# EAGLE design M896 (EAGLE 6.6.0)
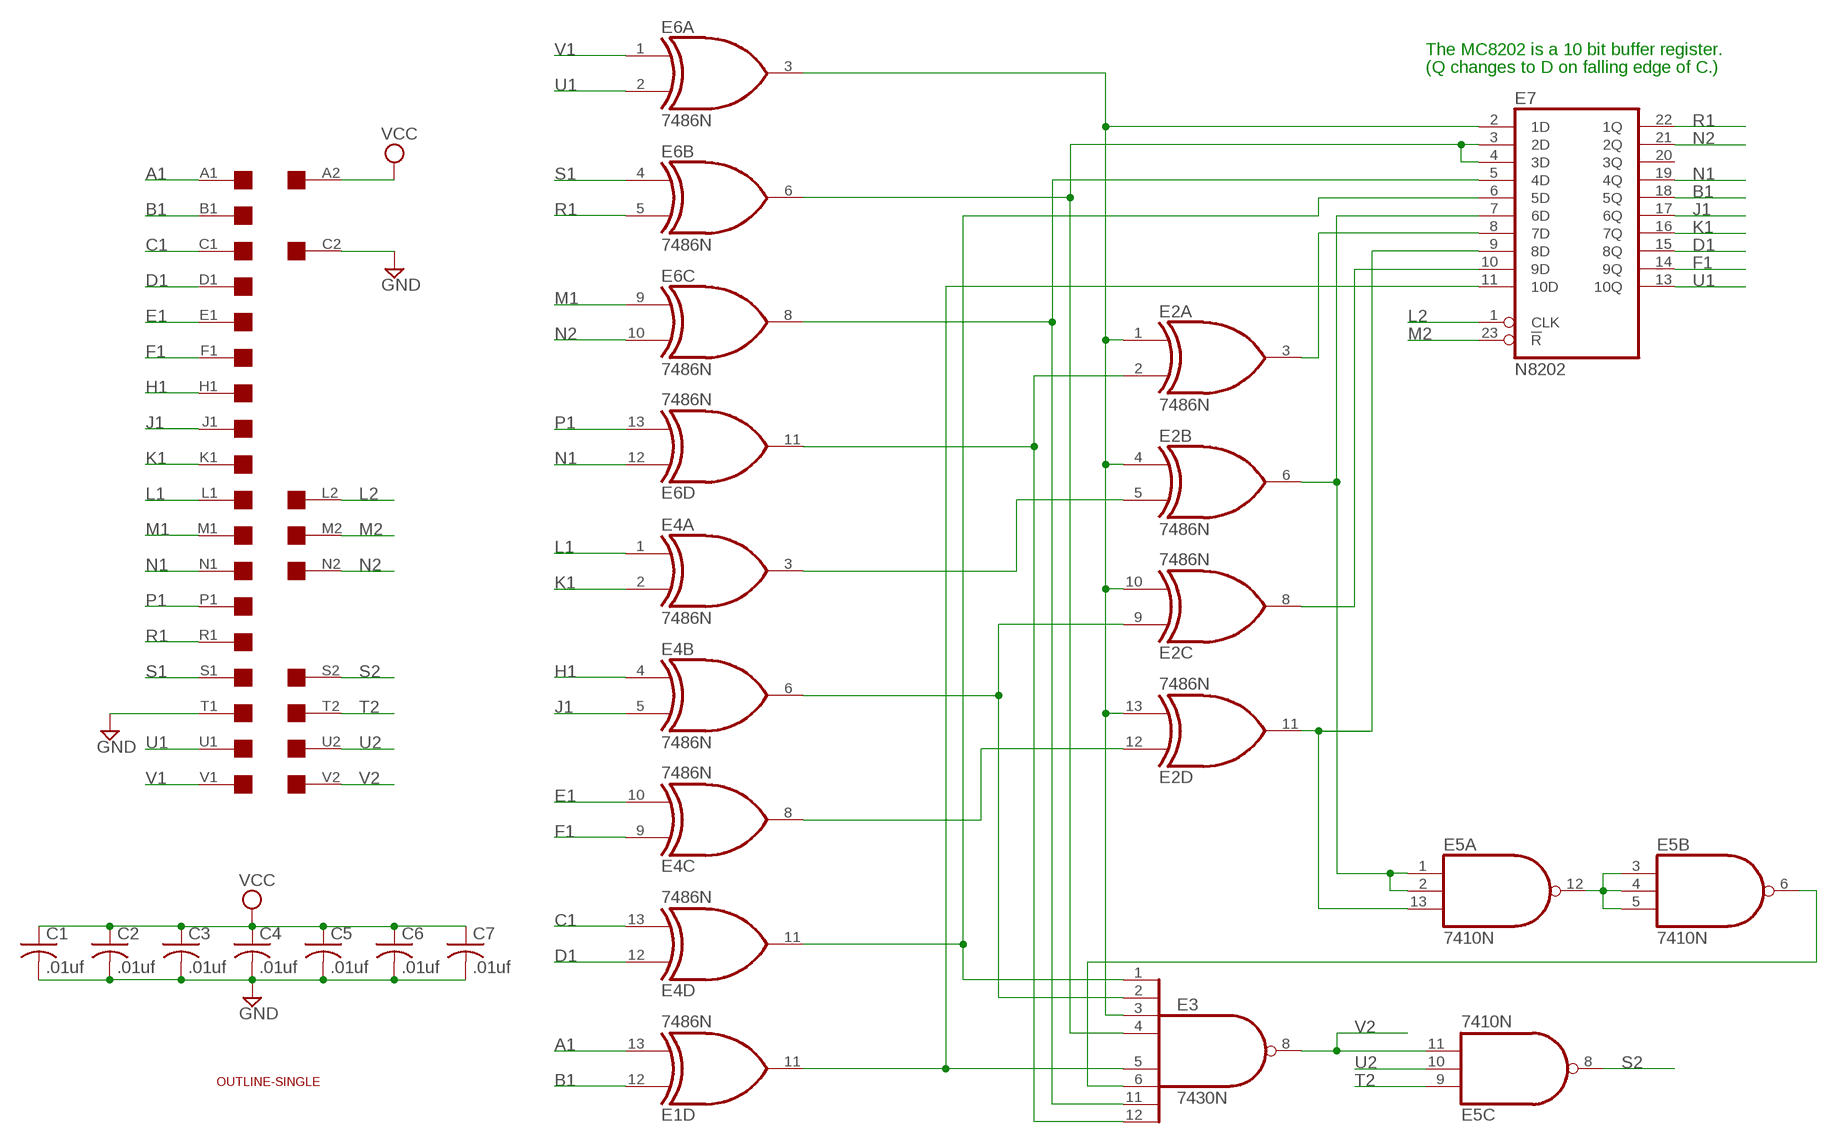
[diagram p0: schematic, sheet 1]

## Parts
C1  .01uf  C-US050-025X075  [C050-025X075]
C2  .01uf  C-US050-025X075  [C050-025X075]
C3  .01uf  C-US050-025X075  [C050-025X075]
C4  .01uf  C-US050-025X075  [C050-025X075]
C5  .01uf  C-US050-025X075  [C050-025X075]
C6  .01uf  C-US050-025X075  [C050-025X075]
C7  .01uf  C-US050-025X075  [C050-025X075]
E1  7486N  [DIL14]
E2  7486N  [DIL14]
E3  7430N  [DIL14]
E4  7486N  [DIL14]
E5  7410N  [DIL14]
E6  7486N  [DIL14]
E7  N8202  [DIL24]
U$1  EDGE-2CONNECTOR  [EDGE-CON2]
U$4  OUTLINE-SINGLE  [SINGLE]

## Nets
A1: E1.13(D:I1) U$1.A1
B1: E1.12(D:I0) E7.18(5Q) U$1.B1
C1: E4.13(D:I1) U$1.C1
D1: E4.12(D:I0) E7.15(8Q) U$1.D1
E1: E4.10(C:I1) U$1.E1
F1: E4.9(C:I0) E7.14(9Q) U$1.F1
GND [power]: C1.2 C2.2 C3.2 C4.2 C5.2 C6.2 C7.2 U$1.C2 U$1.T1
H1: E4.4(B:I0) U$1.H1
J1: E4.5(B:I1) E7.17(6Q) U$1.J1
K1: E4.2(A:I1) E7.16(7Q) U$1.K1
L1: E4.1(A:I0) U$1.L1
L2: E7.1(CLK) U$1.L2
M1: E6.9(C:I0) U$1.M1
M2: E7.23(!R) U$1.M2
N1: E6.12(D:I0) E7.19(4Q) U$1.N1
N2: E6.10(C:I1) E7.21(2Q) U$1.N2
N$1: E2.1(A:I0) E2.4(B:I0) E2.10(C:I1) E2.13(D:I1) E3.3(I2) E6.3(A:O) E7.2(1D)
N$2: E2.2(A:I1) E3.12(I7) E6.11(D:O)
N$3: E2.5(B:I1) E4.3(A:O)
N$4: E2.9(C:I0) E3.2(I1) E4.6(B:O)
N$5: E2.12(D:I0) E4.8(C:O)
N$6: E1.11(D:O) E3.5(I4) E7.11(10D)
N$7: E3.1(I0) E4.11(D:O) E7.6(5D)
N$8: E5.3(B:I0) E5.4(B:I1) E5.5(B:I2) E5.12(A:O)
N$9: E3.11(I6) E6.8(C:O) E7.5(4D)
N$10: E3.4(I3) E6.6(B:O) E7.3(2D) E7.4(3D)
N$11: E3.6(I5) E5.6(B:O)
N$12: E2.6(B:O) E5.1(A:I0) E5.2(A:I1) E7.7(6D)
N$13: E2.11(D:O) E5.13(A:I2) E7.9(8D)
N$14: E2.3(A:O) E7.8(7D)
N$15: E2.8(C:O) E7.10(9D)
P1: E6.13(D:I1) U$1.P1
R1: E6.5(B:I1) E7.22(1Q) U$1.R1
S1: E6.4(B:I0) U$1.S1
S2: E5.8(C:O) U$1.S2
T2: E5.9(C:I0) U$1.T2
U1: E6.2(A:I1) E7.13(10Q) U$1.U1
U2: E5.10(C:I1) U$1.U2
V1: E6.1(A:I0) U$1.V1
V2: E3.8(O) E5.11(C:I2) U$1.V2
VCC [power]: C1.1 C2.1 C3.1 C4.1 C5.1 C6.1 C7.1 U$1.A2
Unconnected: E1.1(A:I0) E1.2(A:I1) E1.3(A:O) E1.4(B:I0) E1.5(B:I1) E1.6(B:O) E1.8(C:O) E1.9(C:I0) E1.10(C:I1) E7.20(3Q) U$1.B2 U$1.D2 U$1.E2 U$1.F2 U$1.H2 U$1.J2 U$1.K2 U$1.P2 U$1.R2

## Notes on the sheet
- The MC8202 is a 10 bit buffer register.
- (Q changes to D on falling edge of C.)

## Power pins joined to a net without a drawn wire
GND: E1.7(P:GND) E2.7(P:GND) E3.7(GND) E4.7(P:GND) E5.7(P:GND) E6.7(P:GND) E7.12(GND)
VCC: E1.14(P:VCC) E2.14(P:VCC) E3.14(VCC) E4.14(P:VCC) E5.14(P:VCC) E6.14(P:VCC) E7.24(VCC)

## Library data of the parts
C1-C7 = rcl:C-US: CAPACITOR, American symbol
E1 E2 E4 E6 = 74xx-us:74*86: Quad 2-input EXCLUSIV-OR (XOR) gate
E3 = 74xx-us:74*30: 8-input NAND gate
E5 = 74xx-us:74*10: Triple 3-input NAND gate
E7 = dec-con:N8202: 10 bit register
U$1 = dec-con:EDGE-2: Double-Sided DEC edge connector.
U$4 = dec-con:OUTLINE-*: Board outlines for DEC boards.

## Net classes
1 power: width 0.508 mm

## Board
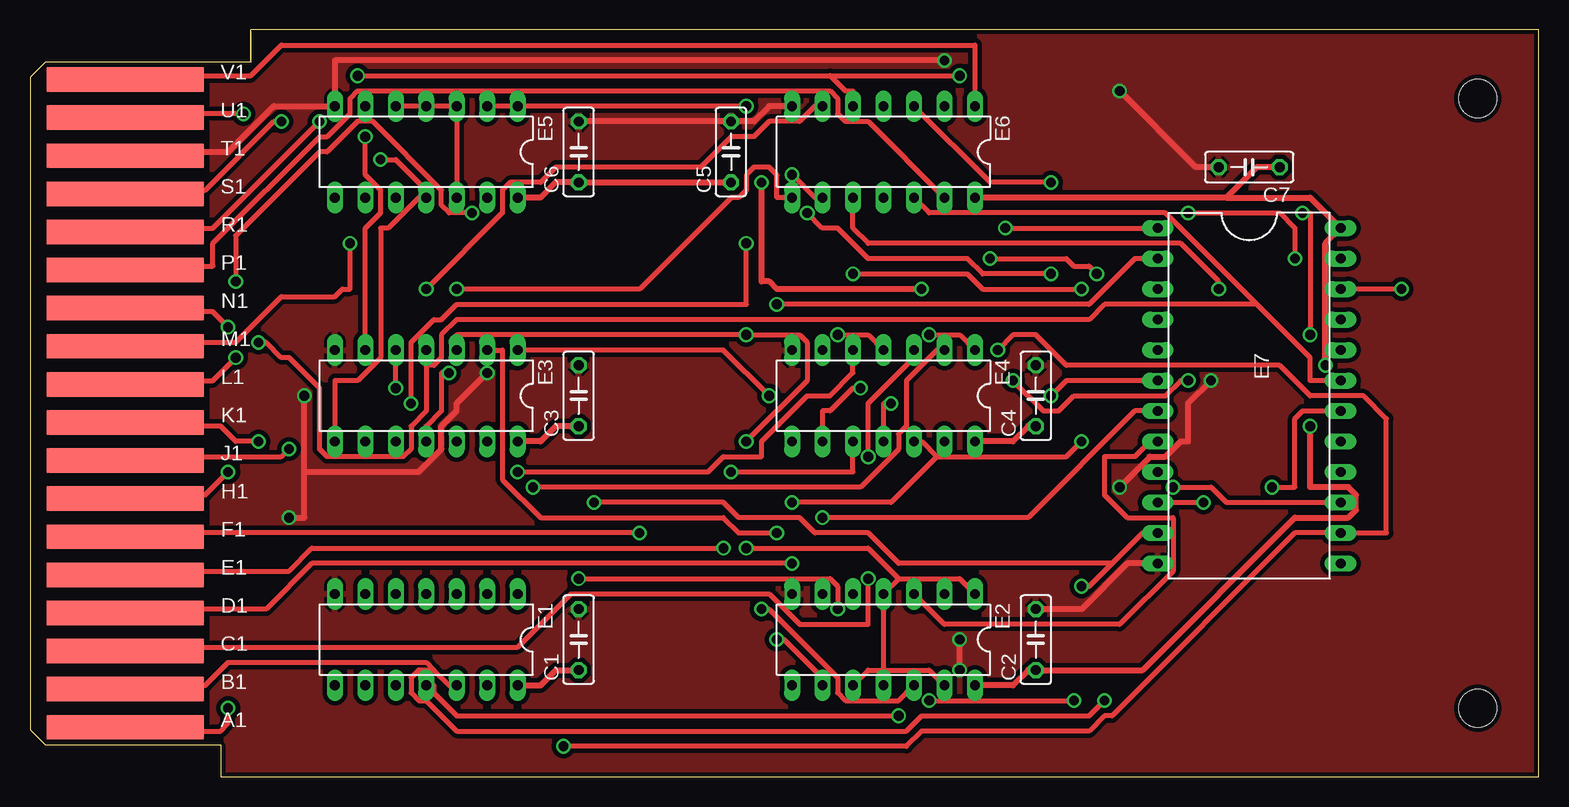
[diagram p1: board, top side]
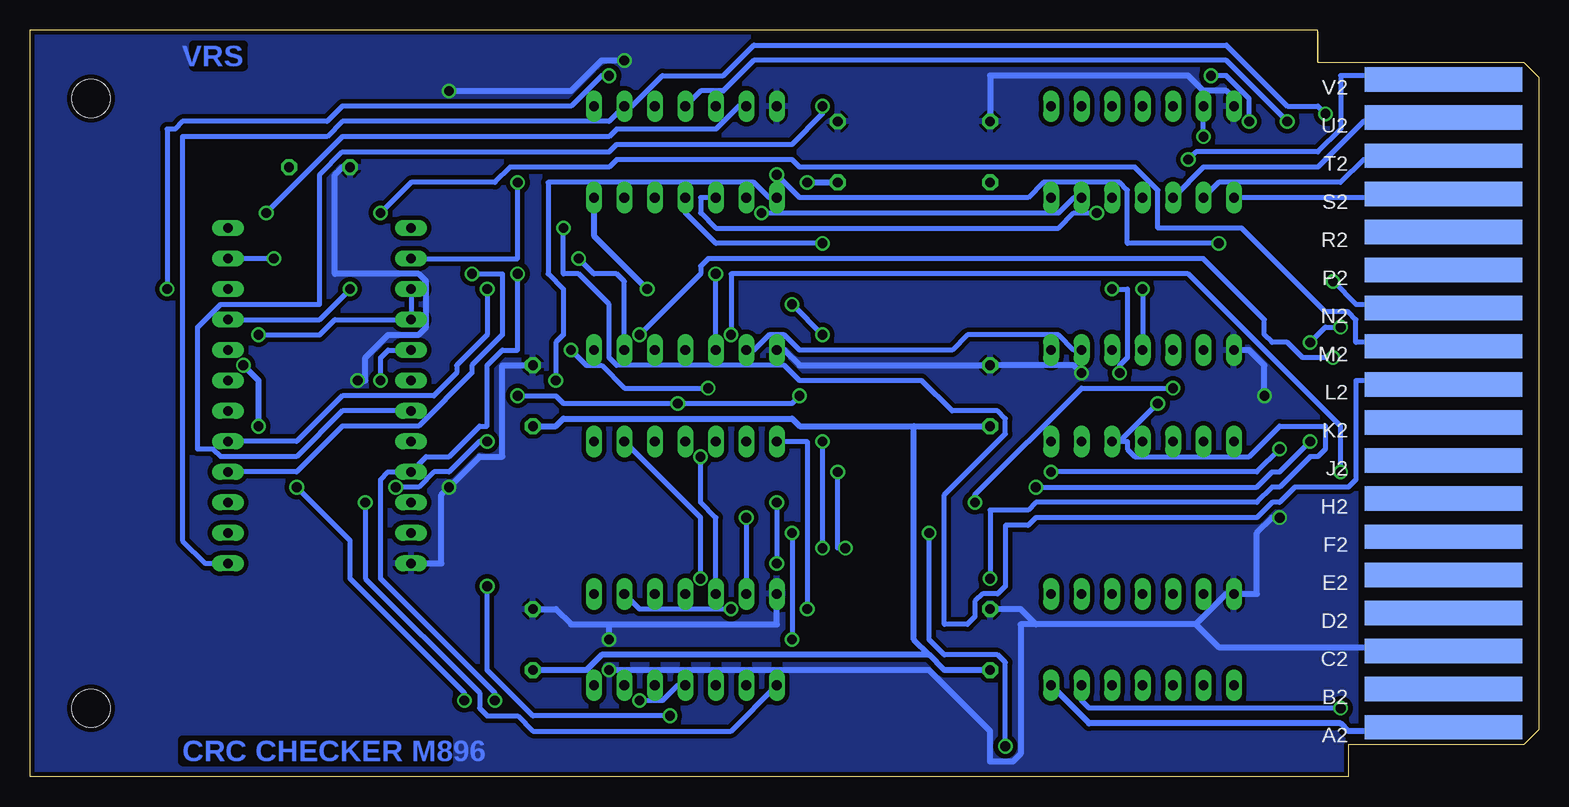
[diagram p2: board, bottom side, seen from below]

Size 125.73 x 62.23 mm. Coordinates in mm from the lower left corner, seen from the top.
Copper layers (1+16): Top 0.035mm / dielectric 1.5mm / Bottom 0.035mm
Design rules "16mils": minimum track width 16mil, minimum drill 32mil, track to track 15mil, track to pad 10mil, pad to pad 10mil, via to via 10mil, smd to smd 10mil, copper to edge 13mil, drill to drill 10mil, minimum pad ring 10mil, minimum via ring 8mil, stop-mask expansion 0mil, vias tented up to drill 0mil, thermal gap 10mil

### Footprints (pad centres in the part's own frame; a part is rotated, then mirrored left to right if it is on the bottom)
C050-025X075 = drill 0.813 octagon: 1 -2.54,0; 2 2.54,0
DIL14 = drill 0.813 long: 1 -7.62,-3.81; 2 -5.08,-3.81; 3 -2.54,-3.81; 4 0,-3.81; 5 2.54,-3.81; 6 5.08,-3.81; 7 7.62,-3.81; 8 7.62,3.81; 9 5.08,3.81; 10 2.54,3.81; 11 0,3.81; 12 -2.54,3.81; 13 -5.08,3.81; 14 -7.62,3.81
DIL24 = drill 0.813 long: 1 -12.7,-7.62; 2 -10.16,-7.62; 3 -7.62,-7.62; 4 -5.08,-7.62; 5 -2.54,-7.62; 6 0,-7.62; 7 2.54,-7.62; 8 5.08,-7.62; 9 7.62,-7.62; 10 10.16,-7.62; 11 12.7,-7.62; 12 15.24,-7.62; 13 15.24,7.62; 14 12.7,7.62; 15 10.16,7.62; 16 7.62,7.62; 17 5.08,7.62; 18 2.54,7.62; 19 0,7.62; 20 -2.54,7.62; 21 -5.08,7.62; 22 -7.62,7.62; 23 -10.16,7.62; 24 -12.7,7.62
EDGE-CON2 = smd 13.106 x 2.032: A1 7.938,4.128; B1 7.938,7.303; C1 7.938,10.477; D1 7.938,13.652; E1 7.938,16.828; F1 7.938,20.003; H1 7.938,23.177; J1 7.938,26.352; K1 7.938,29.527; L1 7.938,32.703; M1 7.938,35.877; N1 7.938,39.053; P1 7.938,42.227; R1 7.938,45.403; S1 7.938,48.578; T1 7.938,51.752; U1 7.938,54.928; V1 7.938,58.102 | smd 13.106 x 2.032 bottom: A2 7.938,4.128; B2 7.938,7.303; C2 7.938,10.477; D2 7.938,13.652; E2 7.938,16.828; F2 7.938,20.003; H2 7.938,23.177; J2 7.938,26.352; K2 7.938,29.527; L2 7.938,32.703; M2 7.938,35.877; N2 7.938,39.053; P2 7.938,42.227; R2 7.938,45.403; S2 7.938,48.578; T2 7.938,51.752; U2 7.938,54.928; V2 7.938,58.102
SINGLE = hole 3.175: 120.65,56.515; 120.65,5.715

### Placement (x,y rotation side)
C1  45.72,11.43 90 top
C2  83.82,11.43 90 top
C3  45.72,31.75 90 top
C4  83.82,31.75 90 top
C5  58.42,52.07 90 top
C6  45.72,52.07 90 top
C7  101.6,50.8 180 top
E1  33.02,11.43 180 top
E2  71.12,11.43 180 top
E3  33.02,31.75 180 top
E4  71.12,31.75 180 top
E5  33.02,52.07 180 top
E6  71.12,52.07 180 top
E7  101.6,33.02 270 top
U$1  0,0 0 top
U$4  0,0 0 top

### Tracks (layer width: path | path; a pad name or v marks a point on that pad's centre or on a via)
A1  (via drill 0.81)
  Top 0.406: v16.51,5.71 16.51,4.45 15.88,3.81 8.26,3.81 U$1.A1
  Bottom 0.406: E1.13 38.1,6.35 37.47,5.71 v16.51,5.71
B1  (via drill 0.81)
  Top 0.406: E1.12 34.93,7.62 33.66,8.89 | 33.66,8.89 33.02,9.53 16.51,9.53 14.61,7.62 8.26,7.62 U$1.B1 | E7.18 106.05,30.48 105.41,29.84 105.41,24.13 v103.51,24.13 | v89.54,6.35 88.27,5.08 74.3,5.08 73.03,3.81 35.56,3.81 33.02,6.35 32.39,6.35 31.75,6.99 31.75,8.26 32.39,8.89 33.66,8.89
  Bottom 0.406: v103.51,24.13 99.06,19.68 99.06,16.51 89.54,6.99 v89.54,6.35
C1  (via drill 0.81)
  Top 0.406: v69.85,16.51 69.85,12.7 64.14,12.7 61.6,15.24 45.09,15.24 40.64,10.79 8.26,10.79 U$1.C1
  Bottom 0.406: E4.13 69.85,21.59 v69.85,16.51
D1  (via drill 0.81)
  Top 0.406: E7.15 99.7,22.86 98.43,24.13 v95.25,24.13 | v87.63,27.94 86.36,26.67 75.57,26.67 | 75.57,26.67 74.3,27.94 E4.12 | v63.5,17.78 23.5,17.78 19.69,13.97 8.26,13.97 U$1.D1 | v63.5,22.86 71.76,22.86 75.57,26.67
  Bottom 0.406: v95.25,24.13 93.35,24.13 92.08,25.4 90.81,25.4 88.27,27.94 v87.63,27.94 | v63.5,22.86 v63.5,17.78
E1  (via drill 0.81)
  Top 0.406: E4.10 68.58,25.4 v58.42,25.4 | v57.79,19.05 23.5,19.05 21.59,17.14 8.26,17.14 U$1.E1
  Bottom 0.406: v58.42,25.4 58.42,19.05 v57.79,19.05
F1  (via drill 0.81)
  Top 0.406: E4.9 66.04,30.48 66.68,30.48 68.58,32.38 v69.22,32.38 | v80.65,35.56 81.92,36.83 83.82,36.83 86.36,34.29 104.14,34.29 106.68,31.75 111.13,31.75 113.03,29.84 113.03,20.32 E7.14 105.41,20.32 90.17,5.08 89.54,5.08 88.27,3.81 74.3,3.81 73.03,2.54 v44.45,2.54 | v50.8,20.32 8.26,20.32 U$1.F1
  Bottom 0.406: v69.22,32.38 76.2,32.38 78.11,34.29 79.38,34.29 v80.65,35.56 | v50.8,20.32 50.8,11.43 49.53,10.16 45.09,10.16 44.45,9.53 v44.45,2.54
GND  (via drill 0.81)
  Top 0.508: E6.7 61.6,55.88 60.33,54.61 C5.2 C6.2 | U$1.T1 8.26,52.07 16.51,52.07 20.32,55.88 E5.7 25.4,59.69 v76.2,59.69 | C2.2 87.63,13.97 91.44,17.78 E7.12 | v98.43,33.02 96.52,31.11 96.52,27.94 95.89,27.94 94.62,26.67 93.35,26.67 v90.81,24.13 | 22.86,25.4 22.86,21.59 v21.59,21.59 | 22.86,25.4 v22.86,31.75 | v38.1,33.66 35.56,31.11 35.56,30.48 34.29,29.21 34.29,27.3 32.39,25.4 22.86,25.4 | v77.47,8.89 v77.47,11.43 | v90.81,57.15 97.16,50.8 C7.2
  Bottom 0.508: C6.2 45.72,58.42 29.21,58.42 27.94,57.15 26.04,57.15 25.4,56.52 E5.7 | E2.7 63.5,12.7 77.47,12.7 | 77.47,12.7 80.65,12.7 81.92,13.97 C2.2 | C4.2 86.36,34.29 86.36,26.67 88.27,26.67 v90.81,24.13 91.44,23.5 91.44,17.78 E7.12 | C7.2 99.7,50.8 100.33,50.16 100.33,41.91 93.35,41.91 92.71,41.27 92.71,37.47 93.35,36.83 95.89,36.83 97.79,34.92 97.79,33.02 v98.43,33.02 | E4.7 62.87,35.56 61.6,34.29 C3.2 38.74,34.29 v38.1,33.66 | C1.2 43.18,13.97 41.91,12.7 | 28.58,12.7 41.91,12.7 | 28.58,12.7 26.04,15.24 E1.7 23.5,15.24 23.5,20.32 22.23,21.59 v21.59,21.59 | E3.7 24.13,35.56 22.86,34.29 v22.86,31.75 | 28.58,12.7 26.67,10.79 8.26,10.79 U$1.C2 | v77.47,11.43 77.47,12.7 | v77.47,8.89 50.8,8.89 45.72,3.81 45.72,1.27 43.82,1.27 43.18,1.91 43.18,12.7 41.91,12.7 | v76.2,59.69 78.11,59.69 80.65,57.15 v90.81,57.15
  pour Top (isolate 0.381): 15.24,62.23 125.73,62.23 125.73,0 15.24,0
  pour Bottom (isolate 0.381): 15.24,62.23 125.73,62.23 125.73,0 15.24,0
H1  (via drill 0.81)
  Top 0.406: E4.4 69.85,36.83 v67.31,36.83 | v16.51,25.4 14.61,23.5 8.26,23.5 U$1.H1
  Bottom 0.406: v67.31,36.83 67.31,41.91 29.21,41.91 16.51,29.21 v16.51,25.4
J1  (via drill 0.81)
  Top 0.406: E4.5 68.58,33.66 66.68,31.75 64.77,31.75 60.96,27.94 60.96,26.67 57.79,26.67 56.52,25.4 v40.64,25.4 | v21.59,27.3 20.96,26.67 8.26,26.67 U$1.J1 | v87.63,40.64 79.38,40.64 78.11,41.91 v68.58,41.91
  Bottom 0.406: v40.64,25.4 23.5,25.4 v21.59,27.3 | E7.17 103.51,27.94 99.7,31.75 92.08,31.75 90.17,33.66 90.17,34.29 87.63,36.83 v87.63,40.64 | E4.5 v68.58,41.91
K1  (via drill 0.81)
  Top 0.406: v88.9,41.91 88.27,42.55 87,42.55 86.36,43.18 v80.01,43.18 | v19.05,27.94 17.15,27.94 15.88,29.21 8.26,29.21 U$1.K1 | v41.91,24.13 69.22,24.13 72.39,27.3 72.39,28.57 73.03,29.21 73.03,33.02 75.57,35.56 E4.2
  Bottom 0.406: E7.16 103.51,25.4 99.7,29.21 93.35,29.21 88.9,33.66 88.9,34.29 86.36,36.83 86.36,41.91 v88.9,41.91 | v80.01,43.18 78.74,41.91 76.84,41.91 76.2,41.27 E4.2 | v19.05,27.94 21.59,25.4 22.23,25.4 23.5,24.13 v41.91,24.13
L1  (via drill 0.81)
  Top 0.406: E4.1 77.47,36.83 v74.93,36.83 | v17.15,34.92 15.24,33.02 8.26,33.02 U$1.L1
  Bottom 0.406: v74.93,36.83 69.85,41.91 69.85,42.55 69.22,43.18 27.94,43.18 22.86,38.1 22.86,36.83 22.23,36.2 20.96,36.2 19.69,34.92 v17.15,34.92
L2  (via drill 0.81)
  Top 0.406: v81.28,45.72 E7.1
  Bottom 0.406: v81.28,45.72 81.28,41.91 80.01,41.91 77.47,39.37 77.47,34.92 76.84,34.29 62.87,34.29 61.6,33.02 51.44,33.02 48.9,30.48 45.09,30.48 44.45,29.84 44.45,28.57 49.53,23.5 49.53,12.7 47.63,12.7 46.99,13.34 46.99,14.61 46.36,15.24 45.09,15.24 44.45,15.88 44.45,20.95 42.55,20.95 41.91,21.59 23.5,21.59 22.23,22.86 21.59,22.86 20.32,24.13 15.88,24.13 15.24,24.77 15.24,33.02 8.26,33.02 U$1.L2
M1  (via drill 0.81)
  Top 0.406: E6.9 65.41,48.26 v63.5,50.16 | v26.67,44.45 26.67,40.64 26.04,40.64 25.4,40.01 20.96,40.01 17.15,36.2 8.26,36.2 U$1.M1
  Bottom 0.406: v63.5,50.16 61.6,48.26 42.55,48.26 41.28,49.53 34.93,49.53 34.29,48.9 34.29,44.45 v26.67,44.45
M2  (via drill 0.81)
  Top 0.406: v105.41,43.18 105.41,45.72 104.14,46.99 v96.52,46.99
  Bottom 0.406: v105.41,43.18 E7.23 | v96.52,46.99 93.98,49.53 87,49.53 85.73,50.8 77.47,50.8 76.84,51.44 62.23,51.44 61.6,50.8 33.66,50.8 31.75,48.9 31.75,45.72 24.77,45.72 17.78,38.73 15.88,38.73 15.24,38.1 15.24,36.2 8.26,36.2 U$1.M2
N1  (via drill 0.81)
  Top 0.406: E6.12 74.93,46.99 94.62,46.99 102.24,39.37 | 102.24,39.37 106.68,34.92 106.68,33.02 E7.19 | v16.51,37.47 15.24,38.73 8.26,38.73 U$1.N1 | v19.05,36.2 19.69,36.2 20.96,34.92 21.59,34.92 24.13,32.38 24.13,27.3 24.77,26.67 31.12,26.67 31.75,27.3 31.75,29.21 33.02,30.48 33.02,34.29 33.66,34.29 34.29,34.92 34.29,36.83 35.56,38.1 88.27,38.1 89.54,39.37 102.24,39.37
  Bottom 0.406: v16.51,37.47 17.78,37.47 v19.05,36.2
N2  (via drill 0.81)
  Top 0.406: E6.10 68.58,45.72 69.85,44.45 95.89,44.45 99.06,41.27 v99.06,40.64 | v17.15,41.27 17.15,45.09 24.13,52.07 24.77,52.07 27.31,54.61 28.58,54.61 34.29,48.9 34.29,47.62 34.93,46.99 v36.83,46.99
  Bottom 0.406: v99.06,40.64 101.6,38.1 E7.21 | v17.15,41.27 15.24,39.37 8.26,39.37 U$1.N2 | v36.83,46.99 38.74,46.99 40.01,45.72 68.58,45.72 69.85,46.99 69.85,48.26 E6.10
N$1  (via drill 0.81)
  Top 0.406: E2.13 74.93,8.89 71.12,8.89 | 71.12,8.89 69.85,8.89 E2.10 | E2.1 77.47,16.51 72.39,16.51 | 72.39,16.51 E2.4 71.12,8.89 | E3.3 35.56,36.83 v59.69,36.83 64.14,36.83 64.77,36.2 64.77,33.02 v59.69,27.94 | v62.23,39.37 88.27,39.37 92.08,43.18 E7.2 | E6.3 80.01,49.53 v85.09,49.53 | 72.39,16.51 69.85,19.05 v59.69,19.05
  Bottom 0.406: v62.23,39.37 v59.69,36.83 | v85.09,49.53 85.09,43.18 E7.2 | v59.69,27.94 v59.69,19.05
N$2  (via drill 0.81)
  Top 0.406: v59.69,44.45 59.69,39.37 35.56,39.37 34.29,38.1 33.66,38.1 31.75,36.2 v31.75,31.11 | v67.31,13.97 67.31,15.88 66.68,16.51 v45.72,16.51
  Bottom 0.406: E6.11 71.12,46.99 68.58,44.45 v59.69,44.45 | 34.93,27.94 v31.75,31.11 | E2.2 74.93,13.97 v67.31,13.97 | v45.72,16.51 45.72,22.23 42.55,22.23 41.91,22.86 23.5,22.86 22.23,24.13 21.59,24.13 19.05,26.67 18.42,26.67 17.78,27.3 17.78,29.21 21.59,29.21 24.13,26.67 33.66,26.67 34.29,27.3 34.29,27.94 34.93,27.94 | 34.93,27.94 E3.12
N$3  (via drill 0.81)
  Top 0.406: E4.3 73.66,34.92 69.85,31.11 v69.85,26.67
  Bottom 0.406: v69.85,26.67 69.85,22.86 68.58,21.59 E2.5
N$4  (via drill 0.81)
  Top 0.406: E2.9 66.04,8.26 62.87,11.43 v62.23,11.43 | v62.23,20.32 59.06,20.32 57.79,21.59 42.55,21.59 39.37,24.77 39.37,35.56 E3.2
  Bottom 0.406: E4.6 65.41,35.56 64.14,36.83 62.87,36.83 61.6,35.56 48.9,35.56 47.63,36.83 40.01,36.83 38.74,35.56 E3.2 | v62.23,20.32 v62.23,11.43
N$5  (via drill 0.81)
  Top 0.406: E2.12 72.39,6.35 67.95,6.35 67.31,6.99 67.31,8.26 61.6,13.97 v60.96,13.97
  Bottom 0.406: v60.96,13.97 60.96,27.94 E4.8
N$6  (via drill 0.81)
  Top 0.406: E7.11 92.71,20.32 90.17,17.78 | 90.17,17.78 88.27,15.88 v87.63,15.88 | v72.39,5.08 35.56,5.08 33.66,6.99 33.66,7.62 E1.11 | v30.48,32.38 E3.5 | v46.99,22.86 57.79,22.86 59.06,21.59 64.14,21.59 65.41,20.32 69.85,20.32 72.39,17.78 90.17,17.78
  Bottom 0.406: v87.63,15.88 87.63,8.89 83.82,5.08 v72.39,5.08 | v30.48,32.38 38.1,32.38 46.99,23.5 v46.99,22.86
N$7  (via drill 0.81)
  Top 0.406: E4.11 71.12,31.11 v71.76,31.11 | v85.09,31.75 86.36,33.02 E7.6 | E3.1 57.79,35.56 v61.6,31.75
  Bottom 0.406: v85.09,31.75 81.92,31.75 81.28,31.11 v71.76,31.11 62.23,31.11 v61.6,31.75
N$8
  Top 0.406: E5.5 E5.4 E5.3 E5.12
N$9  (via drill 0.81)
  Top 0.406: v96.52,33.02 95.89,33.02 94.62,31.75 87,31.75 85.73,30.48 84.46,30.48 v81.92,33.02 | E3.11 33.02,29.21 34.29,30.48 34.29,33.66 v34.93,33.66 | v35.56,40.64 50.8,40.64 58.42,48.26 59.06,48.26 59.69,48.9 59.69,50.16 60.33,50.8 61.6,50.8 62.23,50.16 62.23,48.26 E6.8
  Bottom 0.406: E7.5 95.89,35.56 96.52,34.92 v96.52,33.02 | v81.92,33.02 81.92,36.2 81.28,36.83 81.28,40.64 82.55,41.91 82.55,49.53 65.41,49.53 64.14,48.26 E6.8 | v34.93,33.66 34.93,34.29 34.29,34.92 34.29,40.64 v35.56,40.64
N$10  (via drill 0.81)
  Top 0.406: v33.02,40.64 39.37,46.99 39.37,48.9 40.01,49.53 42.55,49.53 43.82,50.8 55.88,50.8 58.42,53.34 60.33,53.34 61.6,54.61 64.14,54.61 65.41,55.88 E6.6 | v106.68,36.83 106.68,46.99 v106.05,46.99
  Bottom 0.406: E7.3 E7.4 100.33,38.1 101.6,36.83 v106.68,36.83 | v33.02,40.64 E3.4 | v106.05,46.99 99.7,53.34 77.47,53.34 76.84,53.98 68.58,53.98 66.68,55.88 E6.6
N$11  (via drill 0.81)
  Top 0.406: v27.94,53.34 27.94,50.16 29.21,48.9 29.21,46.99 27.94,45.72 E3.6
  Bottom 0.406: v27.94,53.34 E5.6
N$12  (via drill 0.81)
  Top 0.406: E5.2 E5.1 v59.69,55.88 | v66.04,21.59 83.19,21.59 92.08,30.48 E7.7
  Bottom 0.406: v66.04,21.59 E2.6 | v59.69,55.88 59.69,55.24 62.23,52.7 76.84,52.7 77.47,52.07 99.7,52.07 101.6,50.16 101.6,39.37 109.86,39.37 111.76,37.47 111.76,27.3 110.49,27.3 109.86,26.67 103.51,26.67 99.7,30.48 E7.7
N$13  (via drill 0.81)
  Top 0.406: v74.93,6.35 v87,6.35 | v64.77,46.99 66.04,45.72 67.31,45.72 69.85,43.18 78.11,43.18 79.38,41.91 v85.09,41.91
  Bottom 0.406: v87,6.35 87,6.99 96.52,16.51 96.52,24.77 95.89,25.4 E7.9 93.35,25.4 93.35,26.04 92.71,26.67 90.81,26.67 88.27,29.21 87.63,29.21 87.63,34.29 86.36,35.56 85.09,35.56 v85.09,41.91 | v74.93,6.35 73.03,6.35 71.76,7.62 E2.11 | E5.13 38.74,48.26 40.01,46.99 v64.77,46.99
N$14
  Top 0.406: E2.3 76.2,12.7 90.81,12.7 95.25,17.14 95.25,21.59 91.44,21.59 89.54,23.5 89.54,26.67 92.08,26.67 93.35,27.94 E7.8
N$15  (via drill 0.81)
  Top 0.406: E7.10 v97.79,22.86
  Bottom 0.406: E2.8 67.31,3.81 83.82,3.81 85.09,5.08 87.63,5.08 88.27,5.71 88.27,6.99 97.79,16.51 v97.79,22.86
P1
  Top 0.406: E6.13 69.85,54.61 67.95,54.61 67.31,55.24 67.31,56.52 66.68,57.15 27.31,57.15 26.67,56.52 26.67,55.24 24.77,53.34 24.13,53.34 15.24,44.45 15.24,42.55 8.26,42.55 U$1.P1
R1  (via drill 0.81)
  Top 0.406: E6.5 68.58,57.15 67.95,57.15 66.68,58.42 | v27.31,58.42 66.68,58.42 | v24.13,54.61 15.24,45.72 8.26,45.72 U$1.R1 | v114.3,40.64 E7.22 | 66.68,58.42 v77.47,58.42
  Bottom 0.406: v27.31,58.42 26.04,58.42 24.13,56.52 v24.13,54.61 | v114.3,40.64 114.3,53.98 113.67,53.98 113.03,54.61 100.97,54.61 99.7,55.88 80.65,55.88 78.11,58.42 v77.47,58.42
S1  (via drill 0.81)
  Top 0.406: v20.96,54.61 20.32,54.61 14.61,48.9 8.26,48.9 U$1.S1
  Bottom 0.406: E6.4 69.85,57.15 67.95,57.15 65.41,59.69 26.04,59.69 v20.96,54.61
S2
  Bottom 0.406: E5.8 8.26,48.26 U$1.S2
T2
  Bottom 0.406: E5.9 26.67,49.53 16.51,49.53 14.61,51.44 8.26,51.44 U$1.T2
U1  (via drill 0.81)
  Top 0.406: v17.78,55.24 8.26,55.24 U$1.U1
  Bottom 0.406: E7.13 111.13,17.78 113.03,19.68 113.03,53.34 100.97,53.34 99.7,54.61 77.47,54.61 E6.2 75.57,55.88 73.03,58.42 67.95,58.42 65.41,60.96 26.04,60.96 20.96,55.88 18.42,55.88 v17.78,55.24
U2
  Bottom 0.406: E5.10 27.94,50.8 18.42,50.8 14.61,54.61 8.26,54.61 U$1.U2
V1
  Top 0.406: E6.1 78.74,60.96 20.96,60.96 18.42,58.42 8.26,58.42 U$1.V1
V2  (via drill 0.81)
  Top 0.406: v29.21,51.44 30.48,51.44 33.02,48.9 E5.11 32.39,48.26 29.85,45.72 29.21,45.72 29.21,34.92 27.31,33.02 25.4,33.02 E3.8
  Bottom 0.406: v29.21,51.44 28.58,52.07 18.42,52.07 16.51,53.98 16.51,58.42 8.26,58.42 U$1.V2
VCC  (via drill 0.81)
  Top 0.508: E5.14 42.55,48.26 43.82,49.53 C6.1 C5.1 | 99.7,48.26 E6.14 | 99.7,48.26 102.24,50.8 C7.1 | 99.7,48.26 106.68,48.26 E7.24 107.95,44.45 v107.95,34.29 | v60.96,49.53 60.96,41.27 61.6,41.27 62.23,40.64 v74.3,40.64 | E3.14 42.55,27.94 43.82,29.21 C3.1 | E4.14 81.92,27.94 83.19,29.21 C4.1 | E2.14 81.92,7.62 83.19,8.89 C2.1 92.71,8.89 105.41,21.59 109.86,21.59 110.49,22.23 110.49,23.5 109.86,24.13 106.68,24.13 v106.68,29.21 | C1.1 43.82,8.89 42.55,7.62 E1.14
  Bottom 0.508: v60.96,49.53 C5.1 | v74.3,40.64 78.74,45.09 E6.14 | 52.07,29.21 61.6,29.21 62.23,29.84 81.28,29.84 81.92,29.21 C4.1 | 52.07,29.21 C3.1 | E1.14 37.47,4.45 16.51,4.45 15.88,3.81 8.26,3.81 U$1.A2 | C2.1 79.38,8.89 78.11,10.16 50.8,10.16 | 50.8,10.16 49.53,8.89 C1.1 | 52.07,29.21 52.07,11.43 50.8,10.16 | v107.95,34.29 106.68,33.02 v106.68,29.21

### Text on the board
Bottom: VRS | CRC CHECKER M896